# Altium schematic sheet eth_100base-tx_magnetics.SchDoc
size A
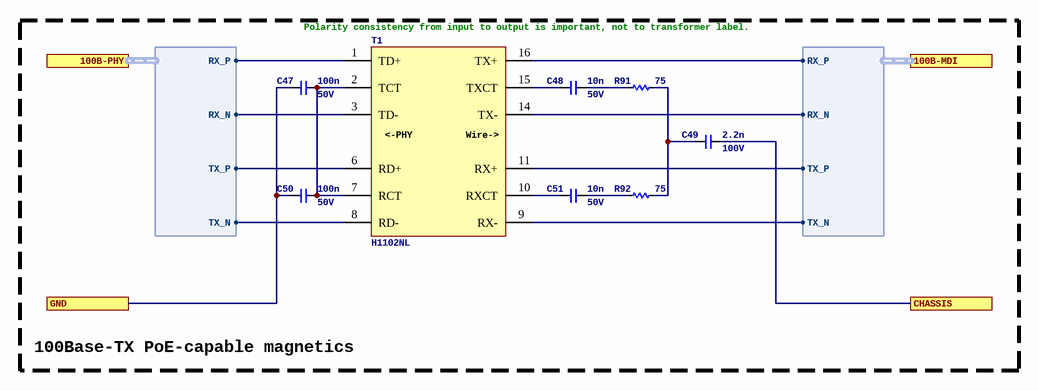
[diagram p0: eth_100base-tx_magnetics.SchDoc]

## Parts
C47  Capacitance: 100n  Voltage Rating: 50V  [C0402]  (hidden comment: CL05B104KB54PNC)
C48  Capacitance: 10n  Voltage Rating: 50V  [C0402]  (hidden comment: CL05B103KB5NNNC)
C49  Capacitance: 2.2n  Voltage Rating: 100V  [C0402]  (hidden comment: CC0402KRX7R0BB222)
C50  Capacitance: 100n  Voltage Rating: 50V  [C0402]  (hidden comment: CL05B104KB54PNC)
C51  Capacitance: 10n  Voltage Rating: 50V  [C0402]  (hidden comment: CL05B103KB5NNNC)
R91  value 75  [R0402]  (hidden comment: 0402WGF750JTCE)
R92  value 75  [R0402]  (hidden comment: 0402WGF750JTCE)
T1  H1102NL  [EPCOS_LAN_MODULE]

## Blocks framed on the sheet
100Base-TX PoE-capable magnetics: C47-C51 R91 R92 T1

## Ports
100B-MDI (harness 100BASE-TX), 100B-PHY (harness 100BASE-TX), CHASSIS, GND

## Harnesses
100BASE-TX: RX_N, RX_P, TX_N, TX_P
100BASE-TX: TX_N, TX_P, RX_N, RX_P

## Nets
CHASSIS: C49.2 ; port CHASSIS
GND: C47.2 C50.2 ; port GND
NetC47_1: C47.1 C50.1 T1.2(TCT) T1.7(RCT)
NetC48_1: C48.1 T1.15(TXCT)
NetC48_2: C48.2 R91.2
NetC49_1: C49.1 R91.1 R92.1
NetC51_1: C51.1 T1.10(RXCT)
NetC51_2: C51.2 R92.2
NetT1_1: T1.1(TD+) ; port 100B-PHY.RX_P
NetT1_3: T1.3(TD-) ; port 100B-PHY.RX_N
NetT1_6: T1.6(RD+) ; port 100B-PHY.TX_P
NetT1_8: T1.8(RD-) ; port 100B-PHY.TX_N
NetT1_9: T1.9(RX-) ; port 100B-MDI.TX_N
NetT1_11: T1.11(RX+) ; port 100B-MDI.TX_P
NetT1_14: T1.14(TX-) ; port 100B-MDI.RX_N
NetT1_16: T1.16(TX+) ; port 100B-MDI.RX_P

## Notes on the sheet
- (near T1) Polarity consistency from input to output is important, not to transformer label.
- (in symbol ETH_H1102NL) <-PHY; Wire->

## Library data of the parts
C47 C50 = CL05B104KB54PNC: Manufacturer: Samsung Electro-Mechanics; Dielectric: X7R; ComponentLink1URL: https://wmsc.lcsc.com/wmsc/upload/file/pdf/v2/lcsc/2304140030_Samsung-Electro-Mechanics-CL05B104KB54PNC_C307331.pdf; ComponentLink1Description: Datasheet; Manufacturer Part Number: CL05B104KB54PNC; Package: 0402; Supplier 2: LCSC; Supplier Part Number 2: C307331
C48 C51 = CL05B103KB5NNNC: Manufacturer: Samsung Electro-Mechanics; Dielectric: X7R; ComponentLink1URL: https://wmsc.lcsc.com/wmsc/upload/file/pdf/v2/lcsc/2304140030_Samsung-Electro-Mechanics-CL05B103KB5NNNC_C15195.pdf; ComponentLink1Description: Datasheet; Manufacturer Part Number: CL05B103KB5NNNC; Package: 0402; Supplier 2: LCSC; Supplier Part Number 2: C15195
C49 = CC0402KRX7R0BB222: Manufacturer: YAGEO; Dielectric: X7R; ComponentLink1URL: https://wmsc.lcsc.com/wmsc/upload/file/pdf/v2/lcsc/2211211800_YAGEO-CC0402KRX7R0BB222_C576731.pdf; ComponentLink1Description: Datasheet; Manufacturer Part Number: CC0402KRX7R0BB222; Package: 0402; Supplier 2: LCSC; Supplier Part Number 2: C576731
R91 R92 = 0402WGF750JTCE: Manufacturer: UNI-ROYAL(Uniroyal Elec); Tolerance: 1%; Temperature Coefficient: Â±100ppm/â„ƒ; Power Rating (mW): 62.5; ComponentLink1Description: Datasheet; ComponentLink1URL: https://wmsc.lcsc.com/wmsc/upload/file/pdf/v2/lcsc/2205311900_UNI-ROYAL-Uniroyal-Elec-0402WGF750JTCE_C25133.pdf; Manufacturer Part Number: 0402WGF750JTCE; Package: 0402; Supplier 2: LCSC; Supplier Part Number 2: C25133
T1 = ETH_H1102NL: MODULE XFRMR SGL ETHR LAN 16SOIC; Manufacturer: Pulse Electronics Corporation; Supplier 1: Digikey; ComponentLink1URL: https://productfinder.pulseelectronics.com/api/open/part-attachments/datasheet/H1102NL; ComponentLink1Description: Datasheet; Supplier Part Number 1: 553-1323-ND; Manufacturer Part Number: H1102NL; Supplier 2: LCSC; Supplier Part Number 2: C18584